# EAGLE design HSTF SMD V20 (EAGLE 8.5.2)
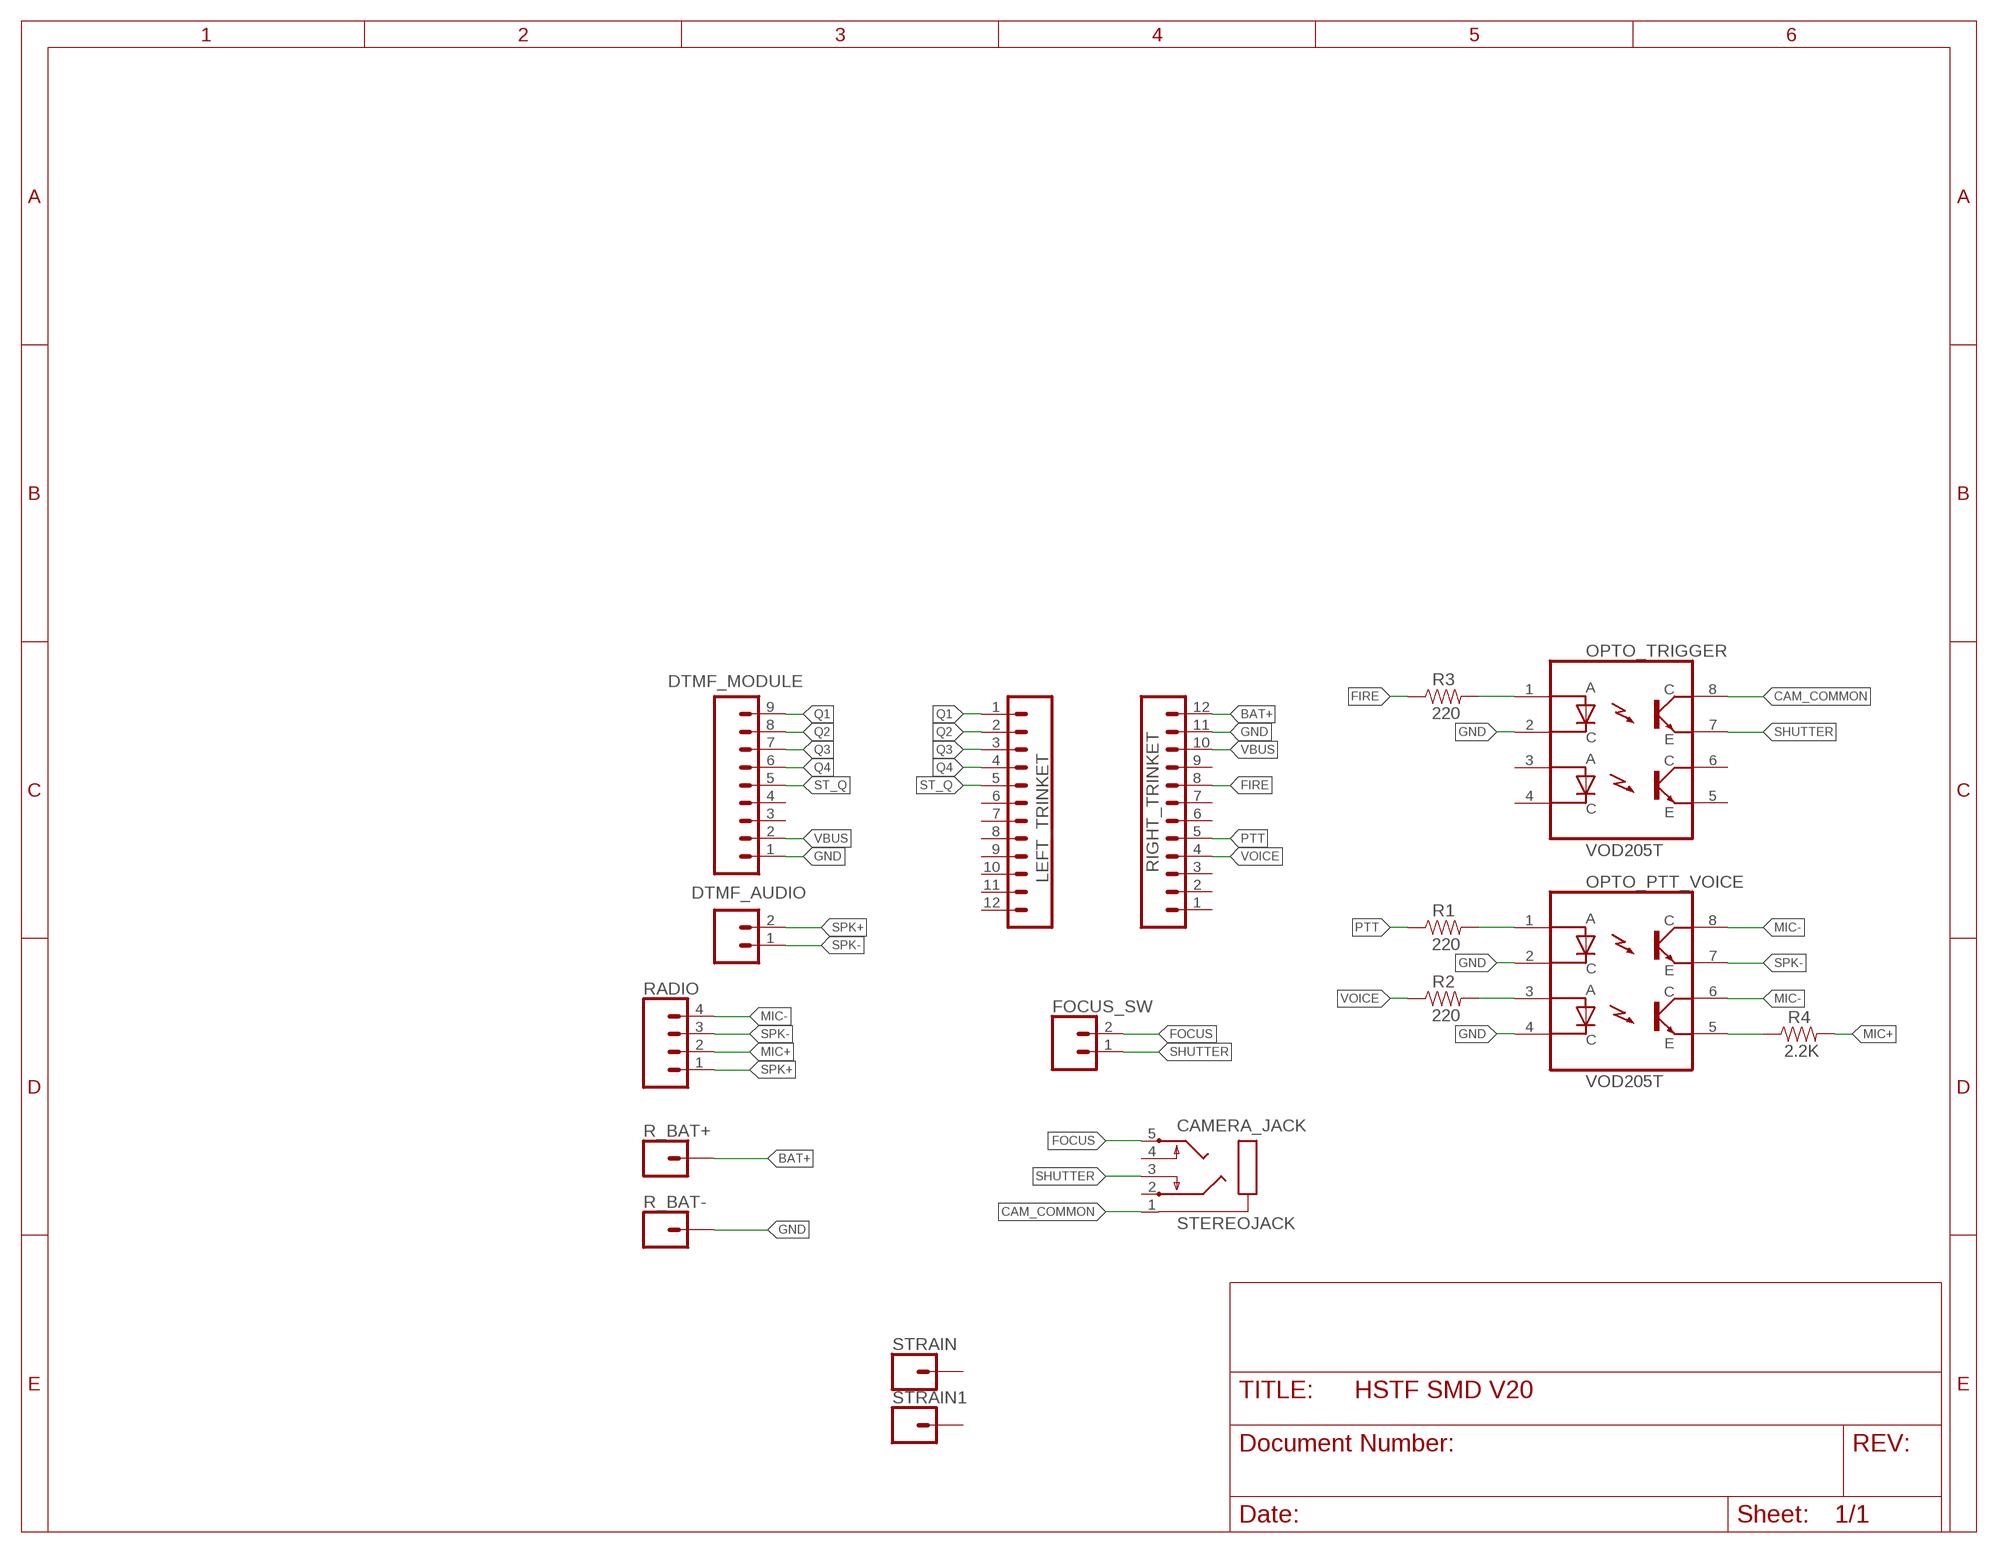
[diagram p0: schematic, sheet 1]

## Parts
CAMERA_JACK  STEREOJACK  [STX3100]
DTMF_AUDIO  CONN_021X02_NO_SILK  [1X02_NO_SILK]
DTMF_MODULE  CONN_09NO_SILK  [1X09_NO_SILK]
FOCUS_SW  CONN_021X02_NO_SILK  [1X02_NO_SILK]
LEFT_TRINKET  CONN_12NO_SILK  [1X12_NO_SILK]
OPTO_PTT_VOICE  VOD205T  [SOIC127P610X331-8N]
OPTO_TRIGGER  VOD205T  [SOIC127P610X331-8N]
R1  220  RESISTOR0805  [0805]
R2  220  RESISTOR0805  [0805]
R3  220  RESISTOR0805  [0805]
R4  2.2K  RESISTOR0805  [0805]
R_BAT+  CONN_01  [1X01]
R_BAT-  CONN_01  [1X01]
RADIO  CONN_04LONGPADS  [1X04_LONGPADS]
RIGHT_TRINKET  CONN_12NO_SILK  [1X12_NO_SILK]
STRAIN  CONN_01  [1X01]
STRAIN1  CONN_01  [1X01]

## Nets
BAT+: R_BAT+.1 RIGHT_TRINKET.12
CAM_COMMON: CAMERA_JACK.1 OPTO_TRIGGER.8(CO2)
FIRE: R3.1 RIGHT_TRINKET.8
FOCUS: CAMERA_JACK.5 FOCUS_SW.2
GND: DTMF_MODULE.1 OPTO_PTT_VOICE.2(C1) OPTO_PTT_VOICE.4(C2) OPTO_TRIGGER.2(C1) R_BAT-.1 RIGHT_TRINKET.11
MIC+: R4.2 RADIO.2
MIC-: OPTO_PTT_VOICE.6(CO1) OPTO_PTT_VOICE.8(CO2) RADIO.4
N$8: OPTO_PTT_VOICE.1(A1) R1.2
N$10: OPTO_PTT_VOICE.3(A2) R2.2
N$12: OPTO_PTT_VOICE.5(E1) R4.1
N$13: OPTO_TRIGGER.1(A1) R3.2
PTT: R1.1 RIGHT_TRINKET.5
Q1: DTMF_MODULE.9 LEFT_TRINKET.1
Q2: DTMF_MODULE.8 LEFT_TRINKET.2
Q3: DTMF_MODULE.7 LEFT_TRINKET.3
Q4: DTMF_MODULE.6 LEFT_TRINKET.4
SHUTTER: CAMERA_JACK.3 FOCUS_SW.1 OPTO_TRIGGER.7(E2)
SPK+: DTMF_AUDIO.2 RADIO.1
SPK-: DTMF_AUDIO.1 OPTO_PTT_VOICE.7(E2) RADIO.3
ST_Q: DTMF_MODULE.5 LEFT_TRINKET.5
VBUS: DTMF_MODULE.2 RIGHT_TRINKET.10
VOICE: R2.1 RIGHT_TRINKET.4
Unconnected: CAMERA_JACK.2 CAMERA_JACK.4 DTMF_MODULE.3 DTMF_MODULE.4 LEFT_TRINKET.6 LEFT_TRINKET.7 LEFT_TRINKET.8 LEFT_TRINKET.9 LEFT_TRINKET.10 LEFT_TRINKET.11 LEFT_TRINKET.12 OPTO_TRIGGER.3(A2) OPTO_TRIGGER.4(C2) OPTO_TRIGGER.5(E1) OPTO_TRIGGER.6(CO1) RIGHT_TRINKET.1 RIGHT_TRINKET.2 RIGHT_TRINKET.3 RIGHT_TRINKET.6 RIGHT_TRINKET.7 RIGHT_TRINKET.9 STRAIN1.1 STRAIN.1

## Library data of the parts
CAMERA_JACK = adafruit:STEREOJACK: MIC/HEADPHONE JACK Stereo jack with two switches. Kycon STX3100, CUI SJ1-3555NG and/or 4UCon 05544
DTMF_AUDIO FOCUS_SW = SparkFun-Connectors:CONN_02: Multi connection point. Often used as Generic Header-pin footprint for 0.1 inch spaced/style header connections On any of the 0.1 inch spaced packages, you can populate with these: Break Away Headers - Straight <https://www.sparkfun.com/products/116> (PRT-00116) Break Away Male Headers - Right Angle <https://www.sparkfun.com/products/553> (PRT-00553) Female Headers <https://www.sparkfun.com/products/115> (PRT-00115) Break Away Headers - Machine Pin <https://www.sparkfun.com/products/117> (PRT-00117) Break Away Female Headers - Swiss Machine Pin <https://www.sparkfun.com/products/743> (PRT-00743) For SCREWTERMINALS and SPRING TERMINALS visit here: Screw Terimnals on SparkFun.com <https://www.sparkfun.com/search/results?term=Screw+Terminals> (5mm/3.5mm/2.54mm spacing) This device is also useful as a general connection point to wire up your design to another part of your project. Our various solder wires solder well into these plated through hole pads. Hook-Up Wire - Assortment (Stranded, 22 AWG) <https://www.sparkfun.com/products/11375> (PRT-11375) Hook-Up Wire - Assortment (Solid Core, 22 AWG) <https://www.sparkfun.com/products/11367> (PRT-11367) View the entire wire category on our website here <https://www.sparkfun.com/categories/141> Special notes: Molex polarized connector foot print use with: PRT-08233 with associated crimp pins and housings. 2.54_SCREWTERM for use with PRT-10571. 3.5mm Screw Terminal footprints for PRT-08084 5mm Screw Terminal footprints for use with PRT-08432
DTMF_MODULE = SparkFun-Connectors:CONN_09: Multi connection point. Often used as Generic Header-pin footprint for 0.1 inch spaced/style header connections On any of the 0.1 inch spaced packages, you can populate with these: Break Away Headers - Straight <https://www.sparkfun.com/products/116> (PRT-00116) Break Away Male Headers - Right Angle <https://www.sparkfun.com/products/553> (PRT-00553) Female Headers <https://www.sparkfun.com/products/115> (PRT-00115) Break Away Headers - Machine Pin <https://www.sparkfun.com/products/117> (PRT-00117) Break Away Female Headers - Swiss Machine Pin <https://www.sparkfun.com/products/743> (PRT-00743) For SCREWTERMINALS and SPRING TERMINALS visit here: Screw Terimnals on SparkFun.com <https://www.sparkfun.com/search/results?term=Screw+Terminals> (5mm/3.5mm/2.54mm spacing) This device is also useful as a general connection point to wire up your design to another part of your project. Our various solder wires solder well into these plated through hole pads. Hook-Up Wire - Assortment (Stranded, 22 AWG) <https://www.sparkfun.com/products/11375> (PRT-11375) Hook-Up Wire - Assortment (Solid Core, 22 AWG) <https://www.sparkfun.com/products/11367> (PRT-11367) View the entire wire category on our website here <https://www.sparkfun.com/categories/141> Special notes: Molex polarized connector foot print use with SKU : PRT-08231 with associated crimp pins and housings. 1MM SMD Version SKU: PRT-10208 NOTES ON THE VARIANTS LOCK and LOCK_LONGPADS... This footprint was designed to help hold the alignment of a through-hole component (i.e. 6-pin header) while soldering it into place. You may notice that each hole has been shifted either up or down by 0.005 of an inch from it's more standard position (which is a perfectly straight line). This slight alteration caused the pins (the squares in the middle) to touch the edges of the holes. Because they are alternating, it causes a "brace" to hold the component in place. 0.005 has proven to be the perfect amount of "off-center" position when using our standard breakaway headers. Although looks a little odd when you look at the bare footprint, once you have a header in there, the alteration is very hard to notice. Also,if you push a header all the way into place, it is covered up entirely on the bottom side.
LEFT_TRINKET RIGHT_TRINKET = SparkFun-Connectors:CONN_12: Multi connection point. Often used as Generic Header-pin footprint for 0.1 inch spaced/style header connections On any of the 0.1 inch spaced packages, you can populate with these: Break Away Headers - Straight <https://www.sparkfun.com/products/116> (PRT-00116) Break Away Male Headers - Right Angle <https://www.sparkfun.com/products/553> (PRT-00553) Female Headers <https://www.sparkfun.com/products/115> (PRT-00115) Break Away Headers - Machine Pin <https://www.sparkfun.com/products/117> (PRT-00117) Break Away Female Headers - Swiss Machine Pin <https://www.sparkfun.com/products/743> (PRT-00743) For SCREWTERMINALS and SPRING TERMINALS visit here: Screw Terimnals on SparkFun.com <https://www.sparkfun.com/search/results?term=Screw+Terminals> (5mm/3.5mm/2.54mm spacing) This device is also useful as a general connection point to wire up your design to another part of your project. Our various solder wires solder well into these plated through hole pads. Hook-Up Wire - Assortment (Stranded, 22 AWG) <https://www.sparkfun.com/products/11375> (PRT-11375) Hook-Up Wire - Assortment (Solid Core, 22 AWG) <https://www.sparkfun.com/products/11367> (PRT-11367) View the entire wire category on our website here <https://www.sparkfun.com/categories/141> Special notes: Molex polarized connector foot print use with SKU : PRT-08231 with associated crimp pins and housings. 1MM SMD Version SKU: PRT-10208 NOTES ON THE VARIANTS LOCK and LOCK_LONGPADS... This footprint was designed to help hold the alignment of a through-hole component (i.e. 6-pin header) while soldering it into place. You may notice that each hole has been shifted either up or down by 0.005 of an inch from it's more standard position (which is a perfectly straight line). This slight alteration caused the pins (the squares in the middle) to touch the edges of the holes. Because they are alternating, it causes a "brace" to hold the component in place. 0.005 has proven to be the perfect amount of "off-center" position when using our standard breakaway headers. Although looks a little odd when you look at the bare footprint, once you have a header in there, the alteration is very hard to notice. Also,if you push a header all the way into place, it is covered up entirely on the bottom side.
OPTO_PTT_VOICE OPTO_TRIGGER = VOD205T:VOD205T; DESCRIPTION: OPTOISOLATOR 4KV 2CH TRANS 8SOIC; DIGI-KEY_PART_NUMBER: VOD205TCT-ND; DIGI-KEY_PURCHASE_URL: https://www.digikey.com/product-detail/en/vishay-semiconductor-opto-division/VOD205T/VOD205TCT-ND/7612328?WT.z_cid=ref_snapeda&utm_source=snapeda&utm_medium=aggregator&utm_campaign=buynow; MF: Vishay Semiconductor; MP: VOD205T; PACKAGE: SOIC-8 Vishay
R1-R4 = SparkFun-Resistors:RESISTOR: Generic Resistor Package
R_BAT+ R_BAT- STRAIN STRAIN1 = SparkFun-Connectors:CONN_01: Single connection point. Often used as Generic Header-pin footprint for 0.1 inch spaced/style header connections On any of the 0.1 inch spaced packages, you can populate with these: Break Away Headers - Straight <https://www.sparkfun.com/products/116> (PRT-00116) Break Away Male Headers - Right Angle <https://www.sparkfun.com/products/553> (PRT-00553) Female Headers <https://www.sparkfun.com/products/115> (PRT-00115) Break Away Headers - Machine Pin <https://www.sparkfun.com/products/117> (PRT-00117) Break Away Female Headers - Swiss Machine Pin <https://www.sparkfun.com/products/743> (PRT-00743) This device is also useful as a general connection point to wire up your design to another part of your project. Our various solder wires solder well into these plated through hole pads. Hook-Up Wire - Assortment (Stranded, 22 AWG) <https://www.sparkfun.com/products/11375> (PRT-11375) Hook-Up Wire - Assortment (Solid Core, 22 AWG) <https://www.sparkfun.com/products/11367> (PRT-11367) View the entire wire category on our website here <https://www.sparkfun.com/categories/141> Special notes: SMTSO-256-ET is a "flush mount" nut for a 4-40 screw. We mostly use this on specialty testbeds; it is a nice way to connect hardware to your PCB at an adjustable hieght. Also note, the SNAP packages are for using a snappable style connector. We sell a baggie of snaps and they are also used on two LilyPad designs: Snap Assortment - 30 pack (male and female) <https://www.sparkfun.com/products/11347> (DEV-11347) LilyPad Arduino SimpleSnap <https://www.sparkfun.com/products/10941> (DEV-10941) LilyPad SimpleSnap Protoboard <https://www.sparkfun.com/products/10940> (DEV-10940)
RADIO = SparkFun-Connectors:CONN_04: Multi connection point. Often used as Generic Header-pin footprint for 0.1 inch spaced/style header connections On any of the 0.1 inch spaced packages, you can populate with these: Break Away Headers - Straight <https://www.sparkfun.com/products/116> (PRT-00116) Break Away Male Headers - Right Angle <https://www.sparkfun.com/products/553> (PRT-00553) Female Headers <https://www.sparkfun.com/products/115> (PRT-00115) Break Away Headers - Machine Pin <https://www.sparkfun.com/products/117> (PRT-00117) Break Away Female Headers - Swiss Machine Pin <https://www.sparkfun.com/products/743> (PRT-00743) For SCREWTERMINALS and SPRING TERMINALS visit here: Screw Terimnals on SparkFun.com <https://www.sparkfun.com/search/results?term=Screw+Terminals> (5mm/3.5mm/2.54mm spacing) This device is also useful as a general connection point to wire up your design to another part of your project. Our various solder wires solder well into these plated through hole pads. Hook-Up Wire - Assortment (Stranded, 22 AWG) <https://www.sparkfun.com/products/11375> (PRT-11375) Hook-Up Wire - Assortment (Solid Core, 22 AWG) <https://www.sparkfun.com/products/11367> (PRT-11367) View the entire wire category on our website here <https://www.sparkfun.com/categories/141> Special notes: Molex polarized connector foot print use with SKU : PRT-08231 with associated crimp pins and housings. 1MM SMD Version SKU: PRT-10208; PROD_ID: CONN-09696

## Board
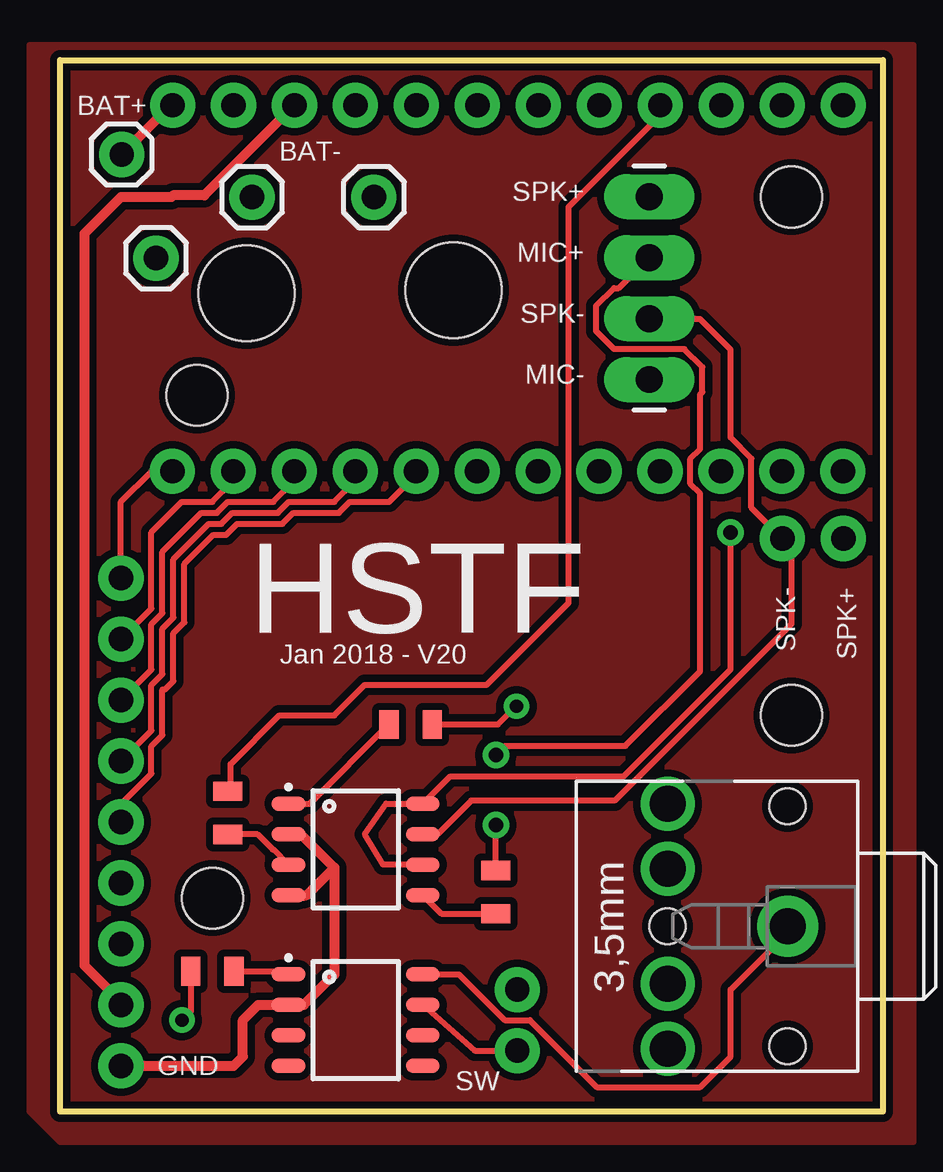
[diagram p1: board, top side]
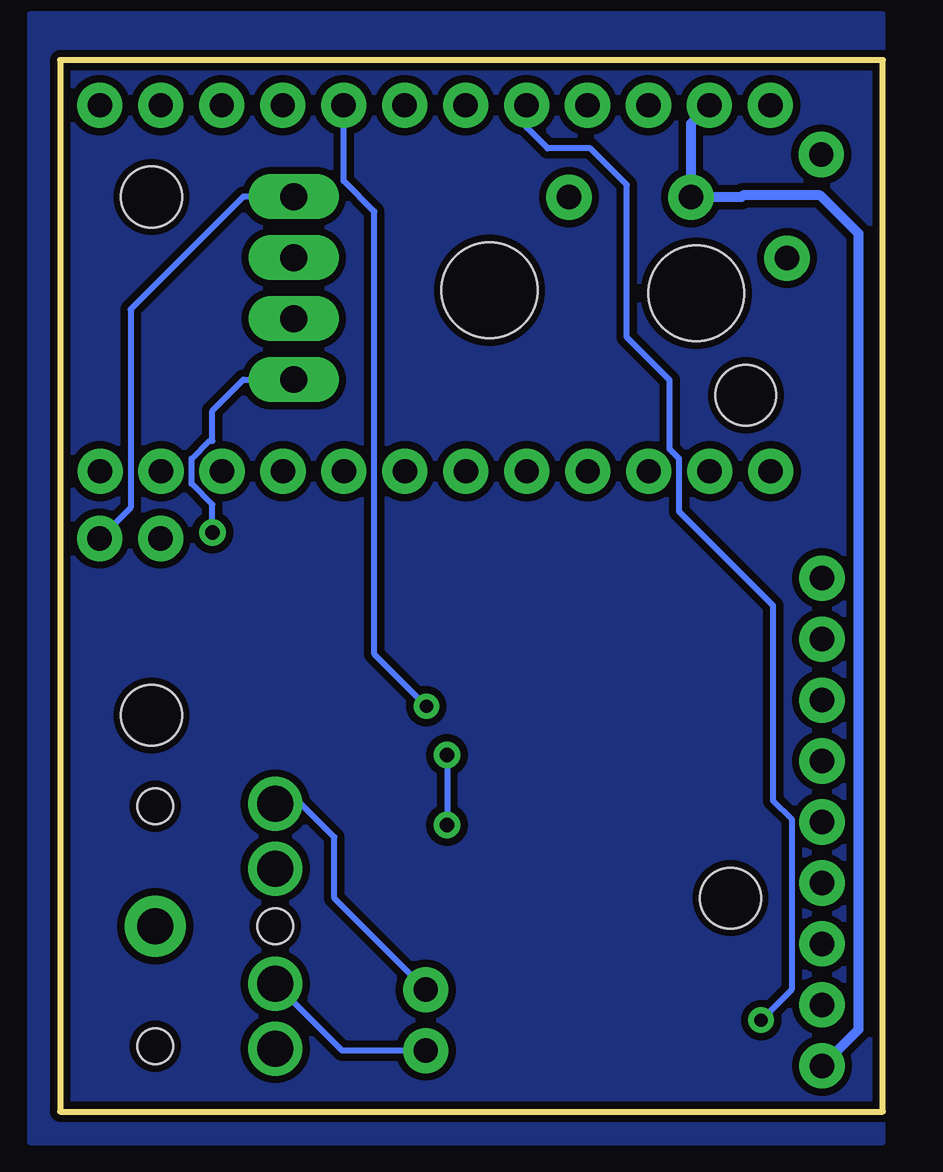
[diagram p2: board, bottom side, seen from below]

Size 34.29 x 43.81 mm. Coordinates in mm from the lower left corner, seen from the top.
Outline: 0,0 0,43.81 34.29,43.81 34.29,0 0,0
Copper layers (1*16): Top 0.035mm / dielectric 1.5mm / Bottom 0.035mm
Design rules "SparkFun": minimum track width 8mil, minimum drill 20mil, track to track 8mil, track to pad 8mil, pad to pad 8mil, via to via 8mil, smd to smd 8mil, copper to edge 10mil, drill to drill 8mil, minimum pad ring 12mil, minimum via ring 10mil, stop-mask expansion 4mil, vias tented up to drill 25mil, thermal gap 10mil
Holes 4 mm at 16.4,34.22 7.78,34.09
Holes 2.54 mm at 30.48,16.51 30.48,38.1 5.71,29.84 6.35,8.89

### Footprints (pad centres in the part's own frame; a part is rotated, then mirrored left to right if it is on the bottom)
STX3100 = drill 1.5 pad 2.54: 1 2.7,-0.1 | drill 1.5: 2 7.7,5; 3 7.7,2.3; 4 7.7,-2.5; 5 7.7,-5.2 | hole 1.5: 2.7,4.9; 2.7,-5.1; 7.7,-0.1
1X02_NO_SILK = drill 1.016 pad 1.88: 1 0,0; 2 2.54,0
1X09_NO_SILK = drill 1.016 pad 1.88: 1 0,0; 2 2.54,0; 3 5.08,0; 4 7.62,0; 5 10.16,0; 6 12.7,0; 7 15.24,0; 8 17.78,0; 9 20.32,0
1X12_NO_SILK = drill 1.016 pad 1.88: 1 0,0; 2 2.54,0; 3 5.08,0; 4 7.62,0; 5 10.16,0; 6 12.7,0; 7 15.24,0; 8 17.78,0; 9 20.32,0; 10 22.86,0; 11 25.4,0; 12 27.94,0
SOIC127P610X331-8N = smd 1.4 x 0.6: 1 -2.8,1.905; 2 -2.8,0.635; 3 -2.8,-0.635; 4 -2.8,-1.905; 5 2.8,-1.905; 6 2.8,-0.635; 7 2.8,0.635; 8 2.8,1.905
0805 = smd 0.8 x 1.2: 1 -0.9,0; 2 0.9,0
1X01 = drill 1.016 pad 1.88: 1 0,0
1X04_LONGPADS = drill 1.118 pad 1.88 long: 1 0,0; 2 2.54,0; 3 5.08,0; 4 7.62,0

### Placement (x,y rotation side)
CAMERA_JACK  33.02,7.62 180 top
DTMF_AUDIO  30.1,23.88 0 top
DTMF_MODULE  2.54,1.91 90 top
FOCUS_SW  19.05,2.54 90 top
LEFT_TRINKET  4.68,26.68 0 top
OPTO_PTT_VOICE  12.32,10.92 0 top
OPTO_TRIGGER  12.32,3.81 0 top
R1  14.61,16.13 180 top
R2  6.99,12.45 270 top
R3  6.35,5.84 0 top
R4  18.16,9.14 90 top
R_BAT+  2.57,39.88 90 top
R_BAT-  8,38.1 90 top
RADIO  24.55,38.12 270 top
RIGHT_TRINKET  32.63,41.93 180 top
STRAIN  4,35.56 90 top
STRAIN1  13.08,38.1 90 top

### Tracks (layer width: path | path; a pad name or v marks a point on that pad's centre or on a via)
BAT+
  Top 0.406: R_BAT+.1 4.62,41.93 RIGHT_TRINKET.12
CAM_COMMON
  Top 0.254: CAMERA_JACK.1 30.42,7.62 30.48,7.62 27.94,5.08 27.94,2.29 26.67,1.02 22.37,1.02 19.58,3.81 18.52,3.81 16.62,5.71 OPTO_TRIGGER.8
FIRE  (via drill 0.55)
  Top 0.254: R3.1 5.45,4.18 v5.08,3.81
  Bottom 0.254: v5.08,3.81 3.81,5.08 3.81,12.19 4.57,12.95 4.57,21.08 8.49,25 8.49,27.21 8.89,27.61 8.89,30.48 10.67,32.26 10.67,38.61 12.19,40.13 13.97,40.13 14.85,41.01 RIGHT_TRINKET.8
FOCUS
  Bottom 0.254: FOCUS_SW.2 22.86,8.89 22.86,11.43 24.25,12.82 CAMERA_JACK.5
GND
  Top 0.254: OPTO_PTT_VOICE.2 10.16,11.43 | 10.16,8.89 OPTO_PTT_VOICE.4
  Top 0.406: DTMF_MODULE.1 7.24,1.91 7.62,2.29 7.62,3.81 8.26,4.45 OPTO_TRIGGER.2 10.16,4.45 11.43,5.71 11.43,10.16 | OPTO_PTT_VOICE.4 10.29,9.02 11.43,10.16 | OPTO_PTT_VOICE.2 10.03,11.56 11.43,10.16
  Bottom 0.406: RIGHT_TRINKET.11 8,41.16 R_BAT-.1 5.9,38.1 5.83,38.18 2.62,38.18 1.02,36.58 1.02,3.43 DTMF_MODULE.1
MIC+  (via drill 0.6)
  Top 0.254: R4.2 v18.16,11.94 | v18.16,14.86 18.54,15.24 23.55,15.24 26.67,18.36 26.67,25.75 26.27,26.15 26.27,27.21 26.67,27.61 26.67,29.88 26.76,29.97 26.76,31.02 26.02,31.77 23.09,31.77 22.34,32.51 22.34,33.56 23.09,34.31 23.28,34.31 RADIO.2
  Bottom 0.254: v18.16,14.86 v18.16,11.94
MIC-  (via drill 0.6)
  Top 0.254: OPTO_PTT_VOICE.6 13.46,10.29 12.7,11.56 13.59,12.83 OPTO_PTT_VOICE.8 16.26,13.97 23.48,13.97 27.94,18.43 v27.94,24.13 27.94,24.26
  Bottom 0.254: v27.94,24.13 27.94,25.28 28.81,26.15 28.81,27.21 28.07,27.95 27.94,27.95 27.94,29.21 26.65,30.5 RADIO.4
N$1
  pour Top (isolate 0.305): 0,-1.27 -1.27,0 -1.27,44.45 35.56,44.45 35.56,-1.27
N$2
  pour Bottom (isolate 0.305): 0,-1.27 0,45.72 35.56,45.72 35.56,-1.27
N$8
  Top 0.254: OPTO_PTT_VOICE.1 10.4,12.83 R1.2
N$10
  Top 0.254: OPTO_PTT_VOICE.3 8.88,10.93 8.86,10.93 8.24,11.55 R2.2
N$12
  Top 0.254: OPTO_PTT_VOICE.5 15.89,8.24 R4.1
N$13
  Top 0.254: R3.2 9.65,5.84 OPTO_TRIGGER.1
PTT  (via drill 0.55 pad 1.05)
  Top 0.254: R1.1 18.26,16.13 v19.02,16.89
  Bottom 0.254: RIGHT_TRINKET.5 22.47,38.77 21.19,37.49 21.19,19.06 v19.02,16.89
Q1
  Top 0.254: DTMF_MODULE.9 2.54,25.4 3.82,26.68 LEFT_TRINKET.1
Q2
  Top 0.254: DTMF_MODULE.8 3.81,20.95 3.81,24.13 5.08,25.4 6.35,25.4 7.22,26.27 LEFT_TRINKET.2
Q3
  Top 0.254: DTMF_MODULE.7 3.81,18.41 3.81,20.31 4.27,20.77 4.27,23.32 5.89,24.94 6.54,24.94 7,25.4 8.89,25.4 9.76,26.27 LEFT_TRINKET.3
Q4
  Top 0.254: DTMF_MODULE.6 3.81,15.88 3.81,17.77 4.27,18.23 4.27,20.12 4.72,20.58 4.72,23.01 6.2,24.49 6.73,24.49 7.19,24.94 9.08,24.94 9.54,25.4 11.43,25.4 12.3,26.27 LEFT_TRINKET.4
SHUTTER
  Top 0.254: OPTO_TRIGGER.7 17.28,2.54 FOCUS_SW.1
  Bottom 0.254: FOCUS_SW.1 22.54,2.54 CAMERA_JACK.3
SPK+
  Bottom 0.254: DTMF_AUDIO.2 31.35,25.16 31.35,33.42 26.65,38.12 RADIO.1
SPK-
  Top 0.254: 15.25,11.43 OPTO_PTT_VOICE.7 15.73,11.56 17.13,12.95 23.11,12.95 30.48,20.32 30.48,23.5 DTMF_AUDIO.1 28.81,25.16 28.81,27.21 27.94,28.08 27.94,31.75 26.67,33.02 24.57,33.02 RADIO.3
ST_Q
  Top 0.254: DTMF_MODULE.5 2.54,12.81 3.81,14.08 3.81,15.23 4.27,15.69 4.27,17.58 4.37,17.58 4.72,17.93 4.72,19.93 5.18,20.39 5.18,22.82 6.39,24.03 6.92,24.03 7.38,24.49 9.27,24.49 9.73,24.94 11.62,24.94 12.08,25.4 13.72,25.4 14.84,26.52 LEFT_TRINKET.5
VBUS
  Top 0.406: RIGHT_TRINKET.10 6.02,38.18 4.71,38.18 4.64,38.1 2.54,38.1 1.02,36.58 1.02,6.1 2.54,4.57 DTMF_MODULE.2
VOICE
  Top 0.254: R2.1 7.11,13.47 7.11,14.48 9.14,16.51 11.43,16.51 12.7,17.78 17.78,17.78 21.19,21.19 21.19,37.7 25.01,41.52 RIGHT_TRINKET.4

### Text on the board
tPlace: BAT+ | BAT- | SPK+ | MIC+ | SPK- | MIC- | SPK- | SPK+ | HSTF | Jan 2018 - V20 | GND | SW